# Altium schematic sheet Sheet1.SchDoc
size 420 x 297 mm; Address1: Address1; Address2: Address2; Address3: Address3; Address4: Address4; DocumentNumber: АБВГ.123456.001 Э3; SheetNumber: 1; Scale: 1:1; DocumentType: Схема электрическая принципиальная; FirstReferrence: АБВГ.123456.001
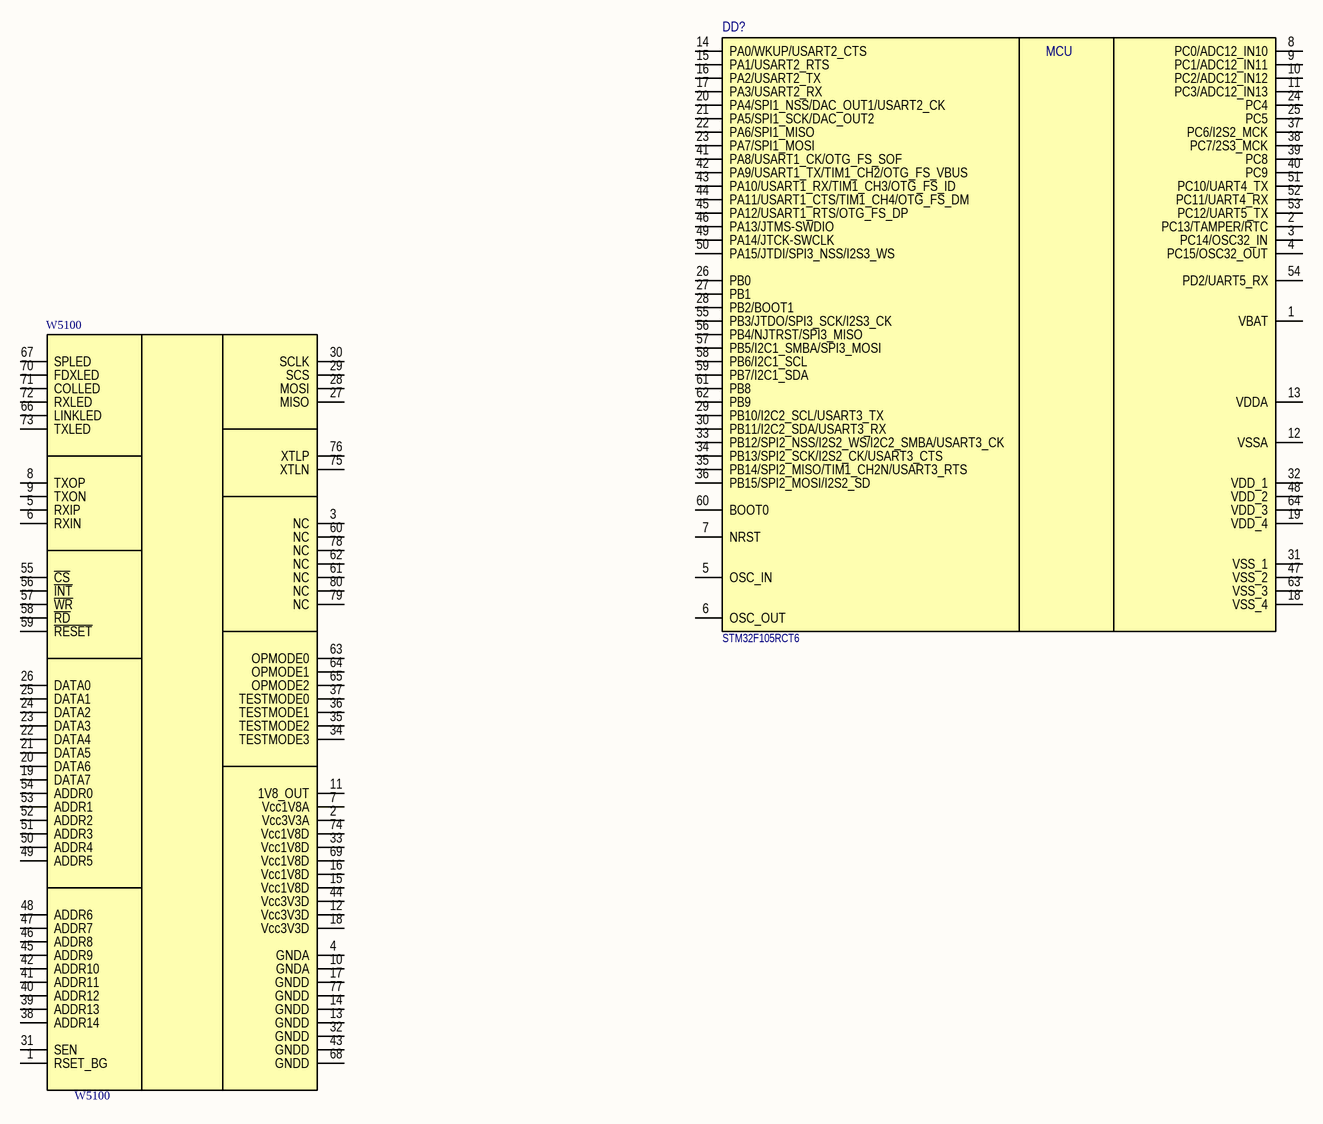
[diagram p0: Sheet1.SchDoc]

## Parts
DD?  ManufacturerPartNumber: STM32F105RCT6  [LQFP-64]  (hidden comment: STM32F105R)
W5100  Микросхема W5100  [LQFP-80]  (value not drawn)

## Nets

Not connected (* = marked no-connect by the designer): DD? 1(VBAT) 2(PC13/TAMPER/RTC) 3(PC14/OSC32_IN) 4(PC15/OSC32_OUT) 5(OSC_IN) 6(OSC_OUT) 7(NRST) 8(PC0/ADC12_IN10) 9(PC1/ADC12_IN11) 10(PC2/ADC12_IN12) 11(PC3/ADC12_IN13) 12(VSSA) 13(VDDA) 14(PA0/WKUP/USART2_CTS) 15(PA1/USART2_RTS) 16(PA2/USART2_TX) 17(PA3/USART2_RX) 18(VSS_4) 19(VDD_4) 20(PA4/SPI1_NSS/DAC_OUT1/USART2_CK) 21(PA5/SPI1_SCK/DAC_OUT2) 22(PA6/SPI1_MISO) 23(PA7/SPI1_MOSI) 24(PC4) 25(PC5) 26(PB0) 27(PB1) 28(PB2/BOOT1) 29(PB10/I2C2_SCL/USART3_TX) 30(PB11/I2C2_SDA/USART3_RX) 31(VSS_1) 32(VDD_1) 33(PB12/SPI2_NSS/I2S2_WS/I2C2_SMBA/USART3_CK) 34(PB13/SPI2_SCK/I2S2_CK/USART3_CTS) 35(PB14/SPI2_MISO/TIM1_CH2N/USART3_RTS) 36(PB15/SPI2_MOSI/I2S2_SD) 37(PC6/I2S2_MCK) 38(PC7/2S3_MCK) 39(PC8) 40(PC9) 41(PA8/USART1_CK/OTG_FS_SOF) 42(PA9/USART1_TX/TIM1_CH2/OTG_FS_VBUS) 43(PA10/USART1_RX/TIM1_CH3/OTG_FS_ID) 44(PA11/USART1_CTS/TIM1_CH4/OTG_FS_DM) 45(PA12/USART1_RTS/OTG_FS_DP) 46(PA13/JTMS-SWDIO) 47(VSS_2) 48(VDD_2) 49(PA14/JTCK-SWCLK) 50(PA15/JTDI/SPI3_NSS/I2S3_WS) 51(PC10/UART4_TX) 52(PC11/UART4_RX) 53(PC12/UART5_TX) 54(PD2/UART5_RX) 55(PB3/JTDO/SPI3_SCK/I2S3_CK) 56(PB4/NJTRST/SPI3_MISO) 57(PB5/I2C1_SMBA/SPI3_MOSI) 58(PB6/I2C1_SCL) 59(PB7/I2C1_SDA) 60(BOOT0) 61(PB8) 62(PB9) 63(VSS_3) 64(VDD_3); W5100 1(RSET_BG) 2(Vcc3V3A) 3(NC) 4(GNDA) 5(RXIP) 6(RXIN) 7(Vcc1V8A) 8(TXOP) 9(TXON) 10(GNDA) 11(1V8_OUT) 12(Vcc3V3D) 13(GNDD) 14(GNDD) 15(Vcc1V8D) 16(Vcc1V8D) 17(GNDD) 18(Vcc3V3D) 19(DATA7) 20(DATA6) 21(DATA5) 22(DATA4) 23(DATA3) 24(DATA2) 25(DATA1) 26(DATA0) 27(MISO) 28(MOSI) 29(SCS) 30(SCLK) 31(SEN) 32(GNDD) 33(Vcc1V8D) 34(TESTMODE3) 35(TESTMODE2) 36(TESTMODE1) 37(TESTMODE0) 38(ADDR14) 39(ADDR13) 40(ADDR12) 41(ADDR11) 42(ADDR10) 43(GNDD) 44(Vcc3V3D) 45(ADDR9) 46(ADDR8) 47(ADDR7) 48(ADDR6) 49(ADDR5) 50(ADDR4) 51(ADDR3) 52(ADDR2) 53(ADDR1) 54(ADDR0) 55(~{CS}) 56(~{INT}) 57(~{WR}) 58(~{RD}) 59(~{RESET}) 60(NC) 61(NC) 62(NC) 63(OPMODE0) 64(OPMODE1) 65(OPMODE2) 66(LINKLED) 67(SPLED) 68(GNDD) 69(Vcc1V8D) 70(FDXLED) 71(COLLED) 72(RXLED) 73(TXLED) 74(Vcc1V8D) 75(XTLN) 76(XTLP) 77(GNDD) 78(NC) 79(NC) 80(NC)

## Notes on the sheet
- Перв. примен.
- Справ. №
- Подп. и дата
- Инв. № дубл.
- Взам. инв. №
- Разраб.
- Изм.
- Лист
- № докум.
- Подп.
- Дата
- Лит.
- Масса
- Масштаб
- Пров.
- Т.контр.
- Листов
- Инв. № подл.
- Утв.
- Н.контр.
- 2.106-A3
- Копировал
- Формат А3
- (in symbol STM32F105RCT6) MCU

## Library data of the parts
DD? = STM32F105RCT6: MCU ARM 256KB FLASH MEM 64-LQFP; Manufacturer: STMicroelectronics; Core Processor: ARM® Cortex-M3™; Core Size: 32-Bit; Speed: 72MHz; Connectivity: CAN, I?C, IrDA, LIN, SPI, UART/USART, USB OTG; Peripherals: DMA, POR, PWM, Voltage Detect, WDT; Number of I /O: 51; Program Memory Size: 256KB (256K x 8); RAM Size: 64K x 8; Voltage - Supply (Vcc/Vdd): 2 V ~ 3.6 V; Data Converters: A/D 16x12b; D/A 2x12b; Oscillator Type: Internal; ID: STM32F105RCT6; Корпус: LQFP-64; ComponentLink1Description: http://www.st.com/internet/com/TECHNICAL_RESOURCES/TECHNICAL_LITERATURE/DATASHEET/CD00220364.pdf; ComponentLink1URL: http://www.st.com/internet/com/TECHNICAL_RESOURCES/TECHNICAL_LITERATURE/DATASHEET/CD00220364.pdf; Supplier 1: Digi-Key; Supplier Part Number 1: 497-8918-ND; RoHS: RoHS Compliant; Category: Integrated Circuits (ICs); Stock 1: 0; Pricing 1: 1=11.33, 10=10.3, 100=8.755, 250=7.98252, 500=7.4675, 1000=6.8495, 2500=6.56625, 5000=6.386 (USD); Package / Case: 64-LQFP; Packaging: Tray; Operating Temperature: -40°C ~ 85°C; Program Memory Type: FLASH; EEPROM Size: -; Manufacturer Part Number: STM32F105RCT6
W5100 = W5100: Ethernet interface; Manufacturer: Wiznet; Supplier 1: Mouser; Supplier Part Number 1: 950-W5100; ManufacturerPartNumber: W5100; ID: W5100; Корпус: LQFP-80